# EasyEDA Pro project 4轴5.0控制板PCB源文件（LY-5X5.0-V3.1）.eprj, schematic 4轴-原理图-V01
Board Name: 4轴PCB; Create Date: 2024-07-26; Page Name: 4轴-原理图-V01; Project Name: LY-5X-V3.1; Schematic Name: 4轴-原理图-V01; Update Date: 2024-12-24; Address1: *; Address2: *; Address3: *; Address4: *; ApprovedBy: *; Author: *; CheckedBy: *; CompanyName: *; CurrentDate: *; CurrentTime: *; Date: *; DocumentFullPathAndName: *; DocumentName: *; DocumentNumber: *; DrawnBy: *; Engineer: *; ImagePath: *; ModifiedDate: *; Organization: *; ProjectName: *; Revision: *; Rule: *; SheetNumber: *; SheetTotal: *; Time: *; Title: *
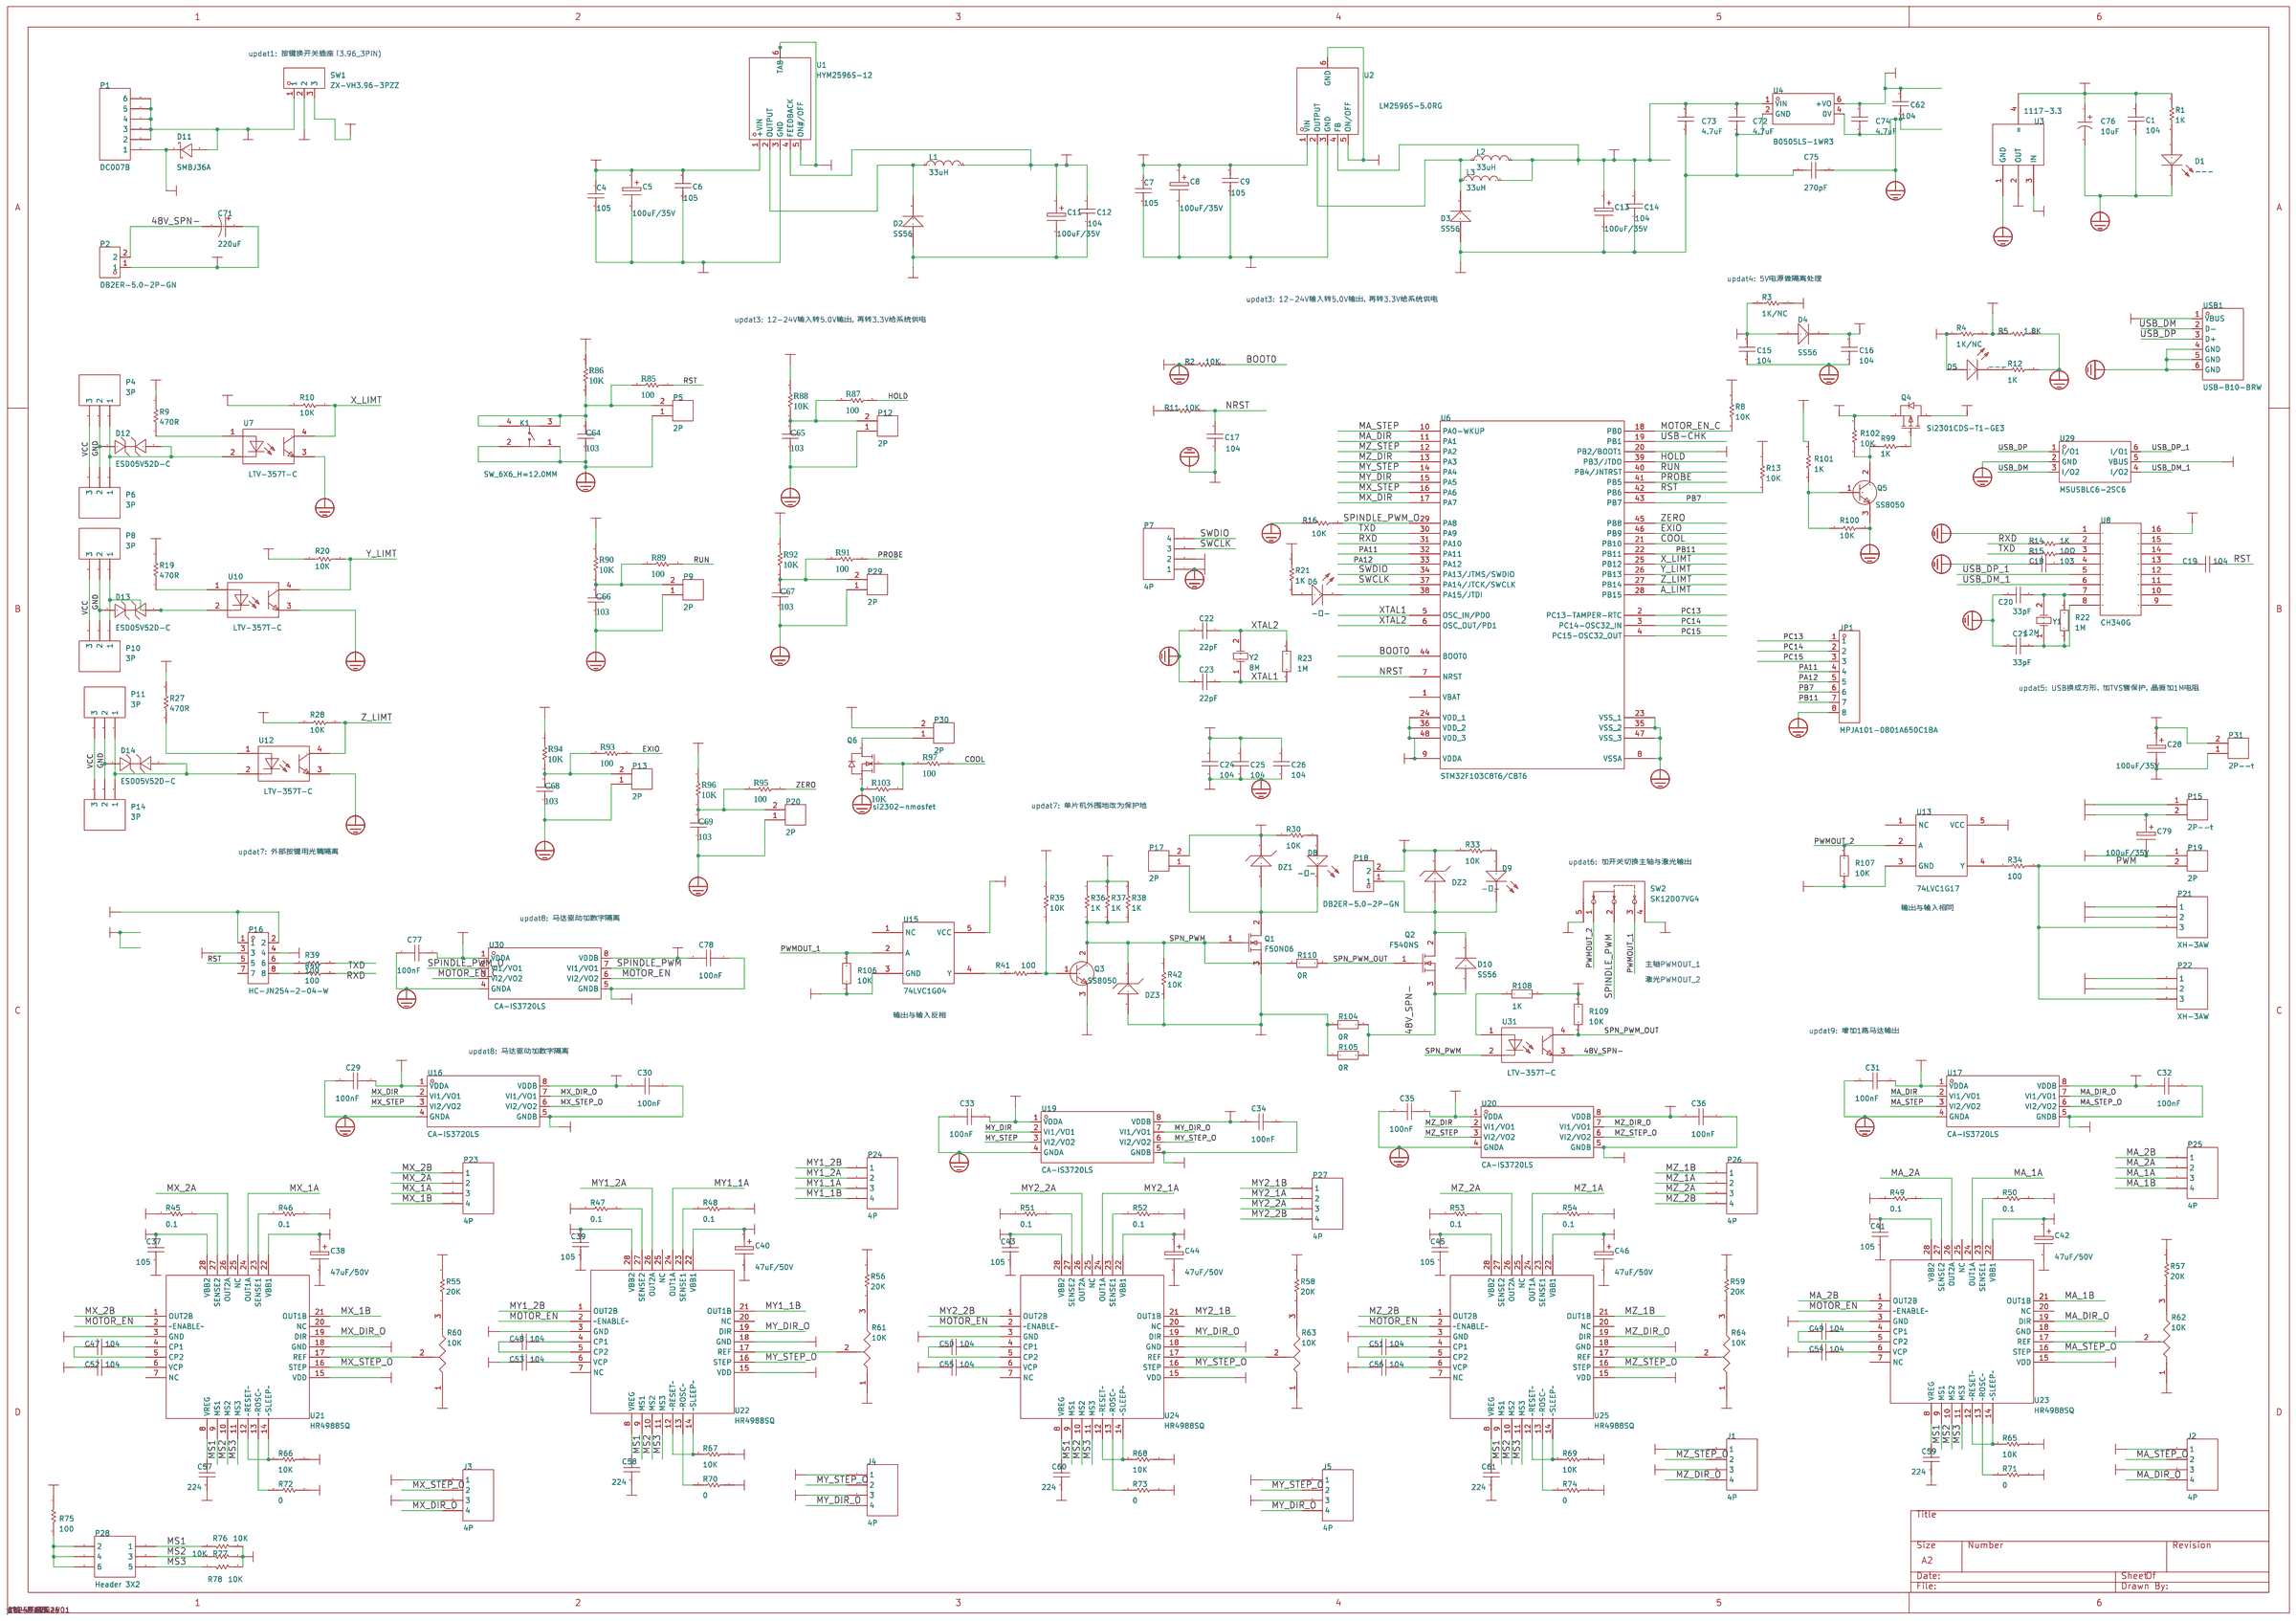
[diagram p0: schematic sheet]

## Parts
C1  104  [C0603]
C4  105  [0805C]
C5  100uF/35V  [电解电容贴片6x6]
C6  105  [0805C]
C7  105  [C0603]
C8  100uF/35V  [电解电容贴片6x6]
C9  105  [C0603]
C11  100uF/35V  [电解电容贴片6x6]
C12  104  [C0603]
C13  100uF/35V  [电解电容贴片6x6]
C14  104  [C0603]
C15  104  [C0603]
C16  104  [C0603]
C17  104  [C0603]
C18  103  [C0603]
C19  104  [C0603]
C20  18pF  [C0603]
C21  18pF  [C0603]
C22  100pF  [C0603]
C23  100pF  [C0603]
C24  104  [C0603]
C25  104  [C0603]
C26  104  [C0603]
C28  100uF/35V  [电解电容贴片6x6]
C29  100nF  [C0603]
C30  100nF  [C0603]
C31  100nF  [C0603]
C32  100nF  [C0603]
C33  100nF  [C0603]
C34  100nF  [C0603]
C35  100nF  [C0603]
C36  100nF  [C0603]
C37  105  [0805C]
C38  47uF/50V  [电解电容贴片6x6]
C39  105  [0805C]
C40  47uF/50V  [电解电容贴片6x6]
C41  105  [0805C]
C42  47uF/50V  [电解电容贴片6x6]
C43  105  [0805C]
C44  47uF/50V  [电解电容贴片6x6]
C45  105  [0805C]
C46  47uF/50V  [电解电容贴片6x6]
C47  104  [C0603]
C48  104  [C0603]
C49  104  [C0603]
C50  104  [C0603]
C51  104  [C0603]
C52  104  [C0603]
C53  104  [C0603]
C54  104  [C0603]
C55  104  [C0603]
C56  104  [C0603]
C57  224  [C0603]
C58  224  [C0603]
C59  224  [C0603]
C60  224  [C0603]
C61  224  [C0603]
C62  104  [C0603]
C64  103  [0603C]
C65  103  [0603C]
C66  103  [0603C]
C67  103  [0603C]
C68  103  [0603C]
C69  103  [0603C]
C71  220uF  [CAP-TH_BD12.5-P5.00-D0.6-FD]
C72  4.7uF  [C0805]
C73  4.7uF  [C0805]
C74  4.7uF  [C0805]
C75  270pF  [CAP-TH_L6.0-W2.5-P5.00-D1.0]
C76  10uF  [C0805]
C77  100nF  [C0603]
C78  100nF  [C0603]
C79  100uF/35V  [电解电容贴片6x6]
D1  ---  [0603LED]
D2  SS56  [SMA]
D3  SS56  [SMA]
D4  SS56  [SMA]
D5  ---  [0603LED]
D6  -̹-  [0603LED]
D8  -̹-  [0603LED]
D9  -̹-  [0603LED]
D10  SS56  [SMA]
D11  SMBJ36A  [SMB_L4.6-W3.6-LS5.3-RD]
D12  ESD05V52D-C  [SOD-523_L1.2-W0.8-LS1.6-BI]
D13  ESD05V52D-C  [SOD-523_L1.2-W0.8-LS1.6-BI]
D14  ESD05V52D-C  [SOD-523_L1.2-W0.8-LS1.6-BI]
DZ1  --ָ-------RS2M  [SMC]
DZ2  --ָ-------RS2M  [SMC]
DZ3  --ѹ------SMAZ10V  [SMA]
J1  4P  [HDR1X4_CON]
J2  4P  [HDR1X4_CON]
J3  4P  [HDR1X4_CON]
J4  4P  [HDR1X4_CON]
J5  4P  [HDR1X4_CON]
JP1  MPJA101-0801A650C1BA  [HDR-TH_8P-P2.54-V-F-R2-C5-S2.54_5-534206-4]
K1  SW_6X6_H=12.0MM  [KEY-SMD_4P-L6.0-W6.0-P4.50-LS9.0]
L1  33uH  [IND-SMD_L13.45-W12.6]
L2  33uH  [IND-SMD_L13.45-W12.6]
L3  33uH  [IND-SMD_L7.0-W7.0_SMDRI74-330MT]
P1  DC007B  [DC007B]
P2  DB2ER-5.0-2P-GN  [CONN-TH_2P-P5.00_DB2ER-5.0-2P-GN]
P4  3P  [HDR1X3_CON]
P5  2P  [HDR1X2_CON]
P6  3P  [HDR1X3_CON]
P7  4P  [SIP4]
P8  3P  [HDR1X3_CON]
P9  2P  [HDR1X2_CON]
P10  3P  [HDR1X3_CON]
P11  3P  [HDR1X3_CON]
P12  2P  [HDR1X2_CON]
P13  2P  [HDR1X2_CON]
P14  3P  [HDR1X3_CON]
P15  2P--ɫ  [HDR1X2_CON]
P16  HC-JN254-2-04-W  [HDR-TH_8P-P2.54-H-F-R2-C4-W9.0]
P17  2P  [CONN-TH_2P-P5.00_DB2ER-5.0-2P-GN]
P18  DB2ER-5.0-2P-GN  [CONN-TH_2P-P5.00_DB2ER-5.0-2P-GN]
P19  2P  [HDR1X2_CON]
P20  2P  [HDR1X2_CON]
P21  XH-3AW  [CONN-TH_3P-P2.54_HCTL_XH-3AW]
P22  XH-3AW  [CONN-TH_3P-P2.54_HCTL_XH-3AW]
P23  4P  [HDR1X4_CON]
P24  4P  [HDR1X4_CON]
P25  4P  [HDR1X4_CON]
P26  4P  [HDR1X4_CON]
P27  4P  [HDR1X4_CON]
P28  Header 3X2  [HDR2X3]
P29  2P  [HDR1X2_CON]
P30  2P  [HDR1X2_CON]
P31  2P--ɫ  [HDR1X2_CON]
Q1  F50N06  [TO-252]
Q2  F540NS  [TO-263-2]
Q3  SS8050  [SOT-23]
Q4  SI2301CDS-T1-GE3  [SOT-23-3_L3.0-W1.7-P0.95-LS2.9-BR]
Q5  SS8050  [SOT-23]
Q6  si2302-nmosfet  [SOT-23-3_L2.9-W1.3-P1.90-LS2.4-BR]
R1  1K  [0603R]
R2  10K  [0603R]
R3  1K/NC  [0603R]
R4  1K/NC  [0603R]
R5  1.8K  [0603R]
R8  10K  [0603R]
R9  470R  [0603R]
R10  10K  [0603R]
R11  10K  [0603R]
R12  1K  [0603R]
R13  10K  [0603R]
R14  1K  [0603R]
R15  10Ω  [0603R]
R16  10K  [0603R]
R19  470R  [0603R]
R20  10K  [0603R]
R21  1K  [0603R]
R22  1M  [R0603]
R23  1M  [R0603]
R27  470R  [0603R]
R28  10K  [0603R]
R30  10K  [0603R]
R33  10K  [0603R]
R34  100  [0603R]
R35  10K  [0603R]
R36  1K  [0603R]
R37  1K  [0603R]
R38  1K  [0603R]
R39  100  [0603R]
R40  100  [0603R]
R41  100  [0603R]
R42  10K  [0603R]
R45  0.1  [0805R]
R46  0.1  [0805R]
R47  0.1  [0805R]
R48  0.1  [0805R]
R49  0.1  [0805R]
R50  0.1  [0805R]
R51  0.1  [0805R]
R52  0.1  [0805R]
R53  0.1  [0805R]
R54  0.1  [0805R]
R55  20K  [0603R]
R56  20K  [0603R]
R57  20K  [0603R]
R58  20K  [0603R]
R59  20K  [0603R]
R60  10K  [松下贴片电位器3x3]
R61  10K  [松下贴片电位器3x3]
R62  10K  [松下贴片电位器3x3]
R63  10K  [松下贴片电位器3x3]
R64  10K  [松下贴片电位器3x3]
R65  10K  [0603R]
R66  10K  [0603R]
R67  10K  [0603R]
R68  10K  [0603R]
R69  10K  [0603R]
R70  0  [0603R]
R71  0  [0603R]
R72  0  [0603R]
R73  0  [0603R]
R74  0  [0603R]
R75  100  [0603R]
R76  10K  [0603R]
R77  10K  [0603R]
R78  10K  [0603R]
R85  100  [0603R]
R86  10K  [0603R]
R87  100  [0603R]
R88  10K  [0603R]
R89  100  [0603R]
R90  10K  [0603R]
R91  100  [0603R]
R92  10K  [0603R]
R93  100  [0603R]
R94  10K  [0603R]
R95  100  [0603R]
R96  10K  [0603R]
R97  100  [0603R]
R99  1K  [0603R]
R100  10K  [0603R]
R101  1K  [0603R]
R102  10K  [0603R]
R103  10K  [0603R]
R104  0R  [R1210]
R105  0R  [R1210]
R106  10K  [R0603]
R107  10K  [R0603]
R108  1K  [R0603]
R109  10K  [R0603]
R110  0R  [R0603]
SW1  ZX-VH3.96-3PZZ  [CONN-TH_3P-P3.96_MEGASTAR_ZX-VH3.96-3PZZ]
SW2  SK12D07VG4  [SW-TH_SK12D07VG4]
U1  HYM2596S-12  [TO-263-5_L10.2-W8.6-P1.70-LS14.4-BR]
U2  LM2596S-5.0RG  [TO-263-5_L10.1-W8.7-P1.70-LS15.2-BR]
U3  1117-3.3  [SOT-223]
U4  B0505LS-1WR3  [PWRM-TH_BXXXXLS-1WR3]
U6  STM32F103C8T6/CBT6  [LQFP48]
U7  LTV-357T-C  [SOP-4_L4.4-W3.9-P2.54-LS7.0-TL]
U8  CH340G  [SOP16]
U10  LTV-357T-C  [SOP-4_L4.4-W3.9-P2.54-LS7.0-TL]
U12  LTV-357T-C  [SOP-4_L4.4-W3.9-P2.54-LS7.0-TL]
U13  74LVC1G17  [SOT-23-5]
U15  74LVC1G04  [SOT-23-5]
U16  CA-IS3720LS  [SOIC-8_L4.9-W3.9-P1.27-LS6.0-BL]
U17  CA-IS3720LS  [SOIC-8_L4.9-W3.9-P1.27-LS6.0-BL]
U19  CA-IS3720LS  [SOIC-8_L4.9-W3.9-P1.27-LS6.0-BL]
U20  CA-IS3720LS  [SOIC-8_L4.9-W3.9-P1.27-LS6.0-BL]
U21  HR4988SQ  [QFN28]
U22  HR4988SQ  [QFN28]
U23  HR4988SQ  [QFN28]
U24  HR4988SQ  [QFN28]
U25  HR4988SQ  [QFN28]
U29  MSUSBLC6-2SC6  [SOT-23-6_L2.9-W1.6-P0.95-LS2.8-BL]
U30  CA-IS3720LS  [SOIC-8_L4.9-W3.9-P1.27-LS6.0-BL]
U31  LTV-357T-C  [SOP-4_L4.4-W3.9-P2.54-LS7.0-TL]
USB1  USB-B10-BRW  [USB-B-TH_USB-B10-BRW]
Y1  12M  [晶振贴片49SSMD]
Y2  8M  [晶振贴片]

## Library data of the parts
C1 C15 C16 C19 = 104: Capacitor (Semiconductor SIM Model); Published: 8-Jun-2000; LatestRevisionDate: 17-Jul-2002; LatestRevisionNote: Re-released for DXP Platform.; PackageReference: C1206; Publisher: Altium Limited; Origin Footprint 2: C1206; Origin Footprint 3: 0402; Origin Footprint 4: 1310[0504]; Origin Footprint 5: 1608[0603]; Origin Footprint 6: C1210; Origin Footprint 7: C0805; Origin Footprint 8: C1206; Origin Footprint 9: 0805; Origin Footprint 10: 0805L; Origin Footprint 1: 0603C; Design Item ID: Cap Semi; Library Name: Miscellaneous Devices
C4 C6 C7 C9 C37 C39 C41 C43 C45 = 105: Design Item ID: CAP; Library Name: SCH--װ--
C5 C8 C11 C13 C28 C79 = 100uF/35V: Origin Footprint 2: X47U; Origin Footprint 1: ________Ƭ6x6; Design Item ID: ELECTRO1; Library Name: *
C12 C14 C47-C56 C62 = 104: Design Item ID: CAP; Library Name: SCH--װ--
C17 = 104: Capacitor (Semiconductor SIM Model); Published: 8-Jun-2000; LatestRevisionDate: 17-Jul-2002; LatestRevisionNote: Re-released for DXP Platform.; PackageReference: C1206; Publisher: Altium Limited; Origin Footprint 2: C1206; Origin Footprint 3: 0402; Origin Footprint 4: 1310[0504]; Origin Footprint 5: 1608[0603]; Origin Footprint 6: C1210; Origin Footprint 7: C0805; Origin Footprint 8: C1206; Origin Footprint 9: 0805; Origin Footprint 10: 0805L; Origin Footprint 1: 0603C; Design Item ID: Cap Semi; Library Name: Miscellaneous Devices; Origin Footprint 11: 0805C
C18 = 103: Capacitor (Semiconductor SIM Model); Published: 8-Jun-2000; LatestRevisionDate: 17-Jul-2002; LatestRevisionNote: Re-released for DXP Platform.; PackageReference: C1206; Publisher: Altium Limited; Origin Footprint 2: C1206; Origin Footprint 3: 0402; Origin Footprint 4: 1310[0504]; Origin Footprint 5: 1608[0603]; Origin Footprint 6: C1210; Origin Footprint 7: C0805; Origin Footprint 8: C1206; Origin Footprint 9: 0805; Origin Footprint 10: 0805L; Origin Footprint 1: 0603C; Design Item ID: Cap Semi; Library Name: Miscellaneous Devices
C20 C21 = 33pF: Capacitor (Semiconductor SIM Model); Published: 8-Jun-2000; LatestRevisionDate: 17-Jul-2002; LatestRevisionNote: Re-released for DXP Platform.; PackageReference: C1206; Publisher: Altium Limited; Origin Footprint 2: C1206; Origin Footprint 3: 0402; Origin Footprint 4: 1310[0504]; Origin Footprint 5: 1608[0603]; Origin Footprint 6: C1210; Origin Footprint 7: C0805; Origin Footprint 8: C1206; Origin Footprint 9: 0805; Origin Footprint 10: 0805L; Origin Footprint 1: 0603C; Design Item ID: Cap Semi; Library Name: Miscellaneous Devices
C22 C23 = 22pF: Capacitor (Semiconductor SIM Model); Published: 8-Jun-2000; LatestRevisionDate: 17-Jul-2002; LatestRevisionNote: Re-released for DXP Platform.; PackageReference: C1206; Publisher: Altium Limited; Origin Footprint 2: C1206; Origin Footprint 3: 0402; Origin Footprint 4: 1310[0504]; Origin Footprint 5: 1608[0603]; Origin Footprint 6: C1210; Origin Footprint 7: C0805; Origin Footprint 8: C1206; Origin Footprint 9: 0805; Origin Footprint 10: 0805L; Origin Footprint 11: 0805C; Origin Footprint 1: 0603C; Design Item ID: Cap Semi; Library Name: Miscellaneous Devices
C24-C26 = 104: Origin Footprint 1: 0603C; Design Item ID: CAP; Library Name: SCH--װ--; Origin Footprint 2: CAP; Origin Footprint 3: 0805C
C29-C36 C77 C78 = CAP_0603: Supplier Footprint: 0603
C38 C40 C42 C44 C46 = 47uF/50V: Origin Footprint 2: X47U; Origin Footprint 1: ________Ƭ6x6; Design Item ID: ELECTRO1; Library Name: *
C57-C61 = 224: Design Item ID: CAP; Library Name: SCH--װ--
C64-C69 = 103: Design Item ID: CAP; Library Name: SCH--װ--
C71 = NXA 100V220 12.5*25: 容值:220uF;精度:±20%;额定电压:100V;; LCSC Part Name: 220uF±20%100V; Supplier Part: C165533; Manufacturer: SAMYOUNG(韩国三莹); Manufacturer Part: NXA100V22012.5*25; Supplier Footprint: 插件,D12.5xL25mm; JLCPCB Part Class: 扩展库; Datasheet: https://atta.szlcsc.com/upload/public/pdf/source/20190920/C430850_914054AA82C37226ADDF1C96892D647D.pdf; Supplier: LCSC; Tolerance: ±20%; Rated Voltage: 100V; Lead Spacing: 5mm; φD: 12.5mm; L: 25mm; Lifetime @ Temp: 10000hrs@105℃
C72-C74 = 1206B475K500NT: 容值:4.7uF;精度:±10%;额定电压:50V;材质(温度系数):X7R;; LCSC Part Name: 4.7uF±10%50V; Supplier Part: C29823; Manufacturer: FH(风华); Supplier Footprint: 1206; JLCPCB Part Class: 基础库; Datasheet: https://atta.szlcsc.com/upload/public/pdf/source/20200305/C486355_26A10D38EF8C2A5C37091D0039909270.pdf; Supplier: LCSC; Tolerance: ±10%; Voltage Rated: 50V; Temperature Coefficient: X7R
C75 = R06B1B271KN0B0S0N0: 容值:270pF;精度:±10%;额定电压:2kV;温度系数:Y5P;; LCSC Part Name: 270pF±10%2kV; Supplier Part: C2914698; Manufacturer: STE(松田); Supplier Footprint: 插件,P=5mm; JLCPCB Part Class: 扩展库; Datasheet: https://atta.szlcsc.com/upload/public/pdf/source/20211109/0AF9471D995859FB5026673B5F5DE464.pdf; Supplier: LCSC; Tolerance: ±10%; Voltage Rated: 2kV; Lead Spacing: 5mm; Temperature Coefficient: Y5P; φD: 6mm; Body Thickness: 3mm
C76 = CL21A106KAYNNNE_C15850: 容值:10uF;精度:±10%;额定电压:25V;材质(温度系数):X5R;; LCSC Part Name: 10uF ±10% 25V; Supplier Part: C15850; Manufacturer: SAMSUNG(三星); Manufacturer Part: CL21A106KAYNNNE; Supplier Footprint: 0805; JLCPCB Part Class: Basic Part; Datasheet: https://atta.szlcsc.com/upload/public/pdf/source/20160218/1457707763339.pdf; Supplier: LCSC; Tolerance: ±10%; Voltage Rated: 25V; Temperature Coefficient: X5R; Rated Voltage: 50V; φD: 5mm; L: 5.4mm; Lifetime @ Temp: 2000hrs@105℃; Operating Temperature: -55℃~+105℃
D1 D5 = ���: Origin Footprint 2: LED(С); Design Item ID: LED; Library Name: SCH--װ--
D2-D4 D10 = SS56: Design Item ID: 1N4148; Library Name: SCH--װ--
D6 D8 D9 = �̹�: Origin Footprint 2: LED(С); Design Item ID: LED; Library Name: SCH--װ--
D11 = SMBJ36A: 反向截止电压(Vrwm):36V;最大钳位电压:58.1V;峰值脉冲电流(Ipp)@10/1000us:10.3A;击穿电压:40V;; Supplier Part: C143165; Manufacturer: FMS(美丽微); Supplier Footprint: SMB(DO-214AA); JLCPCB Part Class: 扩展库; Datasheet: https://atta.szlcsc.com/upload/public/pdf/source/20191125/C461412_D06D094152DCAA63D23E11D143615915.pdf; Supplier: LCSC; Reverse Stand-Off Voltage (Vrwm): 36V; Maximum Clamping Voltage: 58.1V; Peak Pulse Current (Ipp)@10/1000us: 10.3A; Breakdown Voltage: 40V; Type: TVS
D12-D14 = ESD05V52D-C: 极性：双向反向截止电压(Vrwm)：5V击穿电压(VBR)：5.6V钳位电压(Vc)@Ipp：15V反向截止电压(Vrwm)：5V击穿电压(最小值)：5.6V峰值脉冲电流(Ipp)@tp=8/20μs：5A最大钳位电压：15V; Supplier Part: C727170; Manufacturer: TWGMC(台湾迪嘉); Supplier Footprint: SOD-523; JLCPCB Part Class: 扩展库; Datasheet: https://atta.szlcsc.com/upload/public/pdf/source/20200827/C727170_700AFDE065FF081A69A0C04747B3686A.pdf; Supplier: LCSC
DZ1 DZ2 = ��ָ�������RS2M: Design Item ID: --ѹ------; Library Name: SCH--װ--
DZ3 = ��ѹ������SMAZ10V: Design Item ID: --ѹ------; Library Name: SCH--װ--
J1-J5 P7 P23-P27 = 4P: Library Name: SCH--װ--
JP1 = MPJA101-0801A650C1BA: Supplier Part: C9900009548; Supplier Footprint: 3.96间距公座8PIN空偶数PIN; JLCPCB Part Class: 扩展库; Supplier: LCSC
K1 = SW_6X6_H=12.0MM: Supplier Part: C9900018802; Supplier Footprint: KEY-SMD; JLCPCB Part Class: 扩展库; Supplier: LCSC
L1 L2 = MWSA1206S-330MT: 电感值:33uH;精度:±20%;额定电流:5.5A;饱和电流(Isat):6A;类型:-;; LCSC Part Name: 33uH±20%6A; Supplier Part: C408530; Manufacturer: Sunlord(顺络); Supplier Footprint: SMD; JLCPCB Part Class: 扩展库; Datasheet: https://atta.szlcsc.com/upload/public/pdf/source/20231024/D9DB0CBBB5804BFBC9233D4A02F4216A.pdf; Supplier: LCSC; Tolerance: ±20%; Rated Current: 5.5A; Saturation Current (Isat): 6A; DC Resistance (DCR): 75mΩ
L3 = SMDRI74-330MT: 电感值:33uH;精度:±20%;额定电流:960mA;饱和电流(Isat):1.8A;类型:屏蔽电感;; LCSC Part Name: 33uH±20%1.8A; Supplier Part: C49625; Manufacturer: SXN(顺翔诺); Supplier Footprint: SMD,7.5x7.5mm; JLCPCB Part Class: 扩展库; Datasheet: https://atta.szlcsc.com/upload/public/pdf/source/20210810/6F96FDC19AA308DD2AD166FFB9640E87.pdf; Supplier: LCSC; Tolerance: ±20%; Rated Current: 960mA; Saturation Current (Isat): 1.8A; DC Resistance (DCR): 170mΩ; Type: 屏蔽电感
P1 = DC007B: Design Item ID: 6P; Library Name: SCH--װ--
P2 P18 = DB2ER-5.0-2P-GN: 间距:5mm;颜色:绿色;排数:1;每排PIN数:2;额定电流:15A;额定电压:630V;触头镀层:锡;; LCSC Part Name: 5mm排数:1每排P数:2; Supplier Part: C5454428; Manufacturer: DORABO(地博电气); Supplier Footprint: P=5mm; JLCPCB Part Class: 扩展库; Datasheet: https://atta.szlcsc.com/upload/public/pdf/source/20230427/39CC0BD2D36F5E0FC60100946C6C8B3A.pdf; Supplier: LCSC; Pitch: 5mm; Color: 绿色; Number of Pins: 2P; Number of Rows: 1; Number of PINs Per Row: 2; Current Rating (Max): 15A; Voltage Rating (Max): 630V; Contact Plating: 锡
P4 P6 P8 P10 P11 P14 = 3P: Library Name: SCH--װ--
P5 P9 P12 P13 P17 P19 P20 P29 P30 = 2P: Library Name: SCH--װ--
P15 P31 = 2P��ɫ: Design Item ID: 2P; Library Name: SCH--װ--
P16 = HC-JN254-2-04-W: 连接器类型:简牛座;间距:2.54mm;结构:2x4P;额定电流:3A;封装形式:弯插;行距:2.54mm;排数:2;每排PIN数:4;触头材质:黄铜;触头镀层:金;工作温度范围:-40℃~+105℃;焊接温度(最大值):260℃@10S;; LCSC Part Name: 2.54mm2x4P排数:2每排P数:4; Supplier Part: C5372872; Manufacturer: HCTL(华灿天禄); Supplier Footprint: 弯插,P=2.54mm; JLCPCB Part Class: 扩展库; Datasheet: https://atta.szlcsc.com/upload/public/pdf/source/20230314/29278A24539954283B80828B9C32CD4C.pdf; Supplier: LCSC; Connector Type: 简牛座; Pitch: 2.54mm; Structure: 2x4P; Current Rating (Max): 3A; Holder Type: 弯插; Row Spacing: 2.54mm; Number of Rows: 2; Pin Number in each Row: 4; Contact Material: 黄铜; Contact Plating: 金; Operating Temperature Range: -40℃~+105℃; Soldering Temperature(Max): 260℃@10S
P21 P22 = XH-3AW_C2908612: 插针结构:1x3P;间距:2.54mm;安装方式:弯插;参考系列:XH;总PIN数:3P;排数:1;每排PIN数:3;行距:-;额定电流:3A;触头材质:黄铜;触头镀层:锡;工作温度范围:-25℃~+85℃;; LCSC Part Name: 1x3P间距:2.54mm弯插系列:XH; Supplier Part: C2908612; Manufacturer: HCTL(华灿天禄); Supplier Footprint: 弯插,P=2.54mm; JLCPCB Part Class: ExtendedPart; Datasheet: https://atta.szlcsc.com/upload/public/pdf/source/20230711/B565BAF3B11666EF6B81B3605408F2BD.pdf; Supplier: LCSC; Pins Structure: 1x3P; Pitch: 2.54mm; Mounting Style: 弯插; Reference Series: XH; Number of Pins: 3P; Number of Rows: 1; Number of PINs Per Row: 3; Current Rating (Max): 3A; Contact Material: 黄铜; Contact Plating: 锡; Operating Temperature Range: -25℃~+85℃; Design Item ID: 3P; Library Name: SCH--װ--
P28 = Header 3X2: Header, 3-Pin, Dual row; LatestRevisionDate: 17-Jul-2002; LatestRevisionNote: Re-released for DXP Platform.; Publisher: Altium Limited; Library Name: Miscellaneous Connectors
Q1 = F50N06: N-Channel MOSFET; Published: 8-Jun-2000; LatestRevisionDate: 17-Jul-2002; LatestRevisionNote: Re-released for DXP Platform.; PackageVersion: 1995/1996; PackageReference: E3; Publisher: Altium Limited; Design Item ID: MOSFET-N; Library Name: SCH--װ--
Q2 = F540NS: N-Channel MOSFET; Published: 8-Jun-2000; LatestRevisionDate: 17-Jul-2002; LatestRevisionNote: Re-released for DXP Platform.; PackageVersion: 1995/1996; PackageReference: E3; Publisher: Altium Limited; Design Item ID: MOSFET-N; Library Name: SCH--װ--
Q3 Q5 = SS8050: Published: 8-Jun-2000; LatestRevisionDate: 17-Jul-2002; LatestRevisionNote: Re-released for DXP Platform.; PackageReference: TO-226; Publisher: Altium Limited; Code_JEDEC: TO-226-AA; Origin Footprint 2: TO-92; Design Item ID: NPN; Library Name: SCH--װ--
Q4 = SI2301CDS-T1-GE3: 类型:1个P沟道;漏源电压(Vdss):20V;连续漏极电流(Id):3.1A;功率(Pd):860mW；1.6W;导通电阻(RDS(on)@Vgs,Id):112mΩ@4.5V,2.8A;阈值电压(Vgs(th)@Id):1V@250uA;; LCSC Part Name: 1个P沟道耐压:20V电流:3.1A; Supplier Part: C10487; Manufacturer: VISHAY(威世); Supplier Footprint: SOT-23; JLCPCB Part Class: 基础库; Datasheet: https://atta.szlcsc.com/upload/public/pdf/source/20180621/C10487_757133A2CC00440C4C7DD3E7E73681E9.pdf; Supplier: LCSC; Type: 1个P沟道; Drain Source Voltage (Vdss): 20V; Continuous Drain Current (Id): 3.1A; Power Dissipation (Pd): 860mW；1.6W; Drain Source On Resistance (RDS(on)@Vgs,Id): 112mΩ@4.5V,2.8A; Gate Threshold Voltage (Vgs(th)@Id): 1V@250uA; Total Gate Charge (Qg@Vgs): 10nC@4.5V; Input Capacitance (Ciss@Vds): 405pF@10V; Operating Temperature: -55℃~+150℃@(Tj)
Q6 = si2302-nmosfet: Supplier Part: C9900002167; Supplier Footprint: SOT-23; JLCPCB Part Class: 扩展库; Supplier: LCSC
R1 R21 R36-R38 R99 = 1K: Resistor; Published: 8-Jun-2000; LatestRevisionDate: 17-Jul-2002; LatestRevisionNote: Re-released for DXP Platform.; PackageReference: AXIAL-0.3; Publisher: Altium Limited; Origin Footprint 2: AXIAL-0.3; Origin Footprint 3: R0805; Origin Footprint 4: 0805R; Design Item ID: RES; Library Name: SCH--װ--
R2 R11 R16 = 10K: Resistor; Published: 8-Jun-2000; LatestRevisionDate: 17-Jul-2002; LatestRevisionNote: Re-released for DXP Platform.; PackageReference: AXIAL-0.3; Publisher: Altium Limited; Origin Footprint 2: AXIAL-0.3; Origin Footprint 3: 0805R; Origin Footprint 4: 0805R; Design Item ID: RES; Library Name: SCH--װ--
R3 = 1K!!: Resistor; Published: 8-Jun-2000; LatestRevisionDate: 17-Jul-2002; LatestRevisionNote: Re-released for DXP Platform.; PackageReference: AXIAL-0.3; Publisher: Altium Limited; Origin Footprint 2: AXIAL-0.3; Origin Footprint 3: R0805; Design Item ID: RES; Library Name: SCH--װ--
R4 = 1K?: Resistor; Published: 8-Jun-2000; LatestRevisionDate: 17-Jul-2002; LatestRevisionNote: Re-released for DXP Platform.; PackageReference: AXIAL-0.3; Publisher: Altium Limited; Origin Footprint 2: AXIAL-0.3; Origin Footprint 3: R0805; Design Item ID: RES; Library Name: SCH--װ--
R5 = 1.8K: Resistor; Published: 8-Jun-2000; LatestRevisionDate: 17-Jul-2002; LatestRevisionNote: Re-released for DXP Platform.; PackageReference: AXIAL-0.3; Publisher: Altium Limited; Origin Footprint 2: AXIAL-0.3; Origin Footprint 3: R0805; Design Item ID: RES; Library Name: SCH--װ--
R8 = RES: Resistor; Published: 8-Jun-2000; LatestRevisionDate: 17-Jul-2002; LatestRevisionNote: Re-released for DXP Platform.; PackageReference: AXIAL-0.3; Publisher: Altium Limited; Origin Footprint 2: AXIAL-0.3; Origin Footprint 3: 0805R; Library Name: SCH--װ--
R9 R13 R19 R27 R30 R33 R35 R42 R65-R69 R76-R78 R86 R88 R90 R92 R94 R96 R100-R102 = 10K: Resistor; Published: 8-Jun-2000; LatestRevisionDate: 17-Jul-2002; LatestRevisionNote: Re-released for DXP Platform.; PackageReference: AXIAL-0.3; Publisher: Altium Limited; Origin Footprint 2: AXIAL-0.3; Origin Footprint 3: R0805; Origin Footprint 4: 0805R; Design Item ID: RES; Library Name: SCH--װ--
R10 R15 R20 R28 R34 R39-R41 R75 R85 R87 R89 R91 R93 R95 R97 R103 = 100: Resistor; Published: 8-Jun-2000; LatestRevisionDate: 17-Jul-2002; LatestRevisionNote: Re-released for DXP Platform.; PackageReference: AXIAL-0.3; Publisher: Altium Limited; Origin Footprint 2: AXIAL-0.3; Origin Footprint 3: R0805; Origin Footprint 4: 0805R; Design Item ID: RES; Library Name: SCH--װ--
R12 = 1K: Resistor; Published: 8-Jun-2000; LatestRevisionDate: 17-Jul-2002; LatestRevisionNote: Re-released for DXP Platform.; PackageReference: AXIAL-0.3; Publisher: Altium Limited; Origin Footprint 2: AXIAL-0.3; Origin Footprint 3: R0805; Design Item ID: RES; Library Name: SCH--װ--
R14 = 680!!: Resistor; Published: 8-Jun-2000; LatestRevisionDate: 17-Jul-2002; LatestRevisionNote: Re-released for DXP Platform.; PackageReference: AXIAL-0.3; Publisher: Altium Limited; Origin Footprint 2: AXIAL-0.3; Origin Footprint 3: R0805; Origin Footprint 4: 0805R; Design Item ID: RES; Library Name: SCH--װ--
R22 R23 R106-R110 = Res_0603: Supplier Footprint: 0603
R45-R54 = 0.1: Resistor; Published: 8-Jun-2000; LatestRevisionDate: 17-Jul-2002; LatestRevisionNote: Re-released for DXP Platform.; PackageReference: AXIAL-0.3; Publisher: Altium Limited; Origin Footprint 2: AXIAL-0.3; Origin Footprint 3: R0805; Origin Footprint 4: 0603R; Design Item ID: RES; Library Name: SCH--װ--
R55-R59 = 20K: Resistor; Published: 8-Jun-2000; LatestRevisionDate: 17-Jul-2002; LatestRevisionNote: Re-released for DXP Platform.; PackageReference: AXIAL-0.3; Publisher: Altium Limited; Origin Footprint 2: AXIAL-0.3; Origin Footprint 3: R0805; Origin Footprint 4: 0805R; Design Item ID: RES; Library Name: SCH--װ--
R60-R64 = 10K: Design Item ID: --λ--; Library Name: SCH--װ--
R70-R74 = 0: Resistor; Published: 8-Jun-2000; LatestRevisionDate: 17-Jul-2002; LatestRevisionNote: Re-released for DXP Platform.; PackageReference: AXIAL-0.3; Publisher: Altium Limited; Origin Footprint 2: AXIAL-0.3; Origin Footprint 3: R0805; Origin Footprint 4: 0805R; Design Item ID: RES; Library Name: SCH--װ--
R104 R105 = Res_1210: Supplier Footprint: 1210
SW1 = ZX-VH3.96-3PZZ: 插针结构:1x3P;间距:3.96mm;安装方式:直插;参考系列:VH;总PIN数:3P;排数:1;每排PIN数:3;行距:-;额定电流:3A;触头材质:黄铜;触头镀层:锡;工作温度范围:-25℃~+85℃;; Supplier Part: C7429661; Manufacturer: Megastar(兆星); Supplier Footprint: 插件,P=3.96mm; JLCPCB Part Class: 扩展库; Datasheet: https://atta.szlcsc.com/upload/public/pdf/source/20230619/665D90E085E5CFCDC5B674AE560E2F18.pdf; Supplier: LCSC; Pins Structure: 1x3P; Pitch: 3.96mm; Mounting Style: 直插; Reference Series: VH; Number of Pins: 3P; Number of Rows: 1; Number of PINs Per Row: 3; Current Rating (Max): 3A; Contact Material: 黄铜; Contact Plating: 锡; Operating Temperature Range: -25℃~+85℃
SW2 = SK12D07VG4: 电路结构:单刀双掷;安装方式:侧插;额定电流(DC):500mA;额定电压(DC):50V;额定电流(AC):-;额定电压(AC):-;机械寿命:5千次;; LCSC Part Name: 3脚2档位卧插滑动开关; Supplier Part: C393937; Manufacturer: SHOUHAN(首韩); Supplier Footprint: 插件; JLCPCB Part Class: 扩展库; Datasheet: https://atta.szlcsc.com/upload/public/pdf/source/20190521/C393937_939FE26E571CC67D2D532E953108A1B0.pdf; Supplier: LCSC; Circuit: 单刀双掷; Actuator Style: 矩形柱状; Pin Style: PC引脚; Switch Height: 8.8mm; Mounting Style: 侧插; Current Rating (DC): 500mA; Voltage Rating (DC): 50V; Mechanical Life: 5千次
U1 = HYM2596S-12: 功能类型:降压型;输入电压:-;输出电流(最大值):-;; Supplier Part: C166696; Manufacturer: HAOYU(昊昱); Supplier Footprint: TO-263-5; JLCPCB Part Class: 扩展库; Datasheet: https://atta.szlcsc.com/upload/public/pdf/source/20180126/C166697_15169517382381308528.pdf; Supplier: LCSC; Function: 降压型; Switch tube (built-in/external): 内置
U2 = LM2596S-5.0RG_C5157156: Supplier Part: C5157156; Manufacturer: HGC(深圳汉芯); Supplier Footprint: TO-263-5; JLCPCB Part Class: 扩展库; Datasheet: https://atta.szlcsc.com/upload/public/pdf/source/20220308/5E7E021717B07C63974FB4CE30FAB155.pdf; Supplier: LCSC
U3 = 1117-3.3: Design Item ID: LM1117; Library Name: Party600
U4 = B0505LS-1WR3: 转换类型:DC-DC;输入电压(DC):4.5V~5.5V;输出电压:5V;输出电流(最大值):200mA;功能类型:-;; Supplier Part: C909800; Manufacturer: DEXU(德旭电子); Supplier Footprint: 插件; JLCPCB Part Class: 扩展库; Datasheet: https://atta.szlcsc.com/upload/public/pdf/source/20220506/97E51FF679E86FC18F266BBBBBA200F9.pdf; Supplier: LCSC; Conversion Type: DC-DC; Input Voltage(DC): 4.5V~5.5V; Output Voltage: 5V; Output Current (Max): 200mA; Output Channel: 1
U6 = STM32F103C8T6/CBT6: STM32 ARM-based 32-bit MCU with 32 Kbytes Flash, 48-pin LQFP, Industrial Temperature; Published: *; DatasheetVersion: *; PackageVersion: *; PackageReference: *; Publisher: *; PackageDescription: *; ComponentLink1Description: *; ComponentLink1URL: *; ComponentLink2Description: *; ComponentLink2URL: *; Origin Footprint 2: LQFP48_L; Origin Footprint 3: LQFP48_M; Design Item ID: STM32F103C6T6; Library Name: ST Microcontroller 32-Bit STM32 SCH
U7 U10 U12 U31 = LTV-357T-C: 输入电压类型:DC;正向电压:1.2V;输出电流:50mA;隔离电压(rms):3.75kV;反向电压:6V;接收端电压:35V;输出通道数:1;集射极饱和电压(Vce(sat)@Ic,IF):200mV@1mA,20mA;; LCSC Part Name: DC输入隔离电压(rms):3750V; Supplier Part: C119091; Manufacturer: LITEON(光宝); Supplier Footprint: SOP-4-2.54mm; JLCPCB Part Class: 扩展库; Datasheet: https://atta.szlcsc.com/upload/public/pdf/source/20170930/C133128_1506736380934997376.pdf; Supplier: LCSC; Input voltage type: DC; Output Type: 光电三极管; Forward Voltage: 1.2V; Output Current: 50mA; Isolation Voltage(rms): 3.75kV; Reverse Voltage: 6V; Receiving End Voltage: 35V; Number of Outputs: 1; Collector-Emitter Saturation Voltage (Vce(sat)@Ic,IF): 200mV@1mA,20mA; Rise time: 4us@2mA,100Ω; Fall time: 3us@2mA,100Ω; Operating Temperature: -55℃~+110℃
U8 = CH340G: Design Item ID: DIP16; Library Name: SCH--װ--
U13 = 74LVC1G17: Library Name: SCH--װ--
U15 = 74LVC1G04: Design Item ID: 74LVC1G17; Library Name: SCH--װ--
U16 U17 U19 U20 U30 = CA-IS3720LS: LCSC Part Name: CA-IS372x高速双通道数字隔离器; Supplier Part: C5121215; Manufacturer: Chipanalog(川土微); Supplier Footprint: SOIC-8; JLCPCB Part Class: 扩展库; Datasheet: https://atta.szlcsc.com/upload/public/pdf/source/20220817/B10411DCED9A45C0160465FE161A7C01.pdf; Supplier: LCSC
U21-U25 = HR4988SQ: Design Item ID: HR4988; Library Name: SCH--װ--
U29 = MSUSBLC6-2SC6: 反向截止电压(Vrwm):5V;最大钳位电压:15V;峰值脉冲电流(Ipp)@10/1000us:6A;峰值脉冲功率(Ppp)@10/1000us:150W;击穿电压:9V;; LCSC Part Name: UL26; Supplier Part: C2830148; Manufacturer: MSKSEMI(美森科); Supplier Footprint: SOT-23-6; JLCPCB Part Class: 扩展库; Datasheet: https://atta.szlcsc.com/upload/public/pdf/source/20210623/C2830148_830D5495FDC11AF9D5769967D4D0CCFD.pdf; Supplier: LCSC; Reverse Stand-Off Voltage (Vrwm): 5V; Maximum Clamping Voltage: 15V; Peak Pulse Current (Ipp)@10/1000us: 6A; Peak Pulse Power Dissipation (Ppp)@10/1000us: 150W; Breakdown Voltage: 9V; Type: ESD
USB1 = USB-B10-BRW: 连接器类型:Type-B;标准:USB2.0;公母:母;端口数量:1;触点数量:4P;安装方式:弯插;额定电流-电源:1.5A;工作温度范围:-20℃~+70℃;焊接温度(最大值):260℃;; LCSC Part Name: Type-B母弯插; Supplier Part: C720549; Manufacturer: XUNPU(讯普); Supplier Footprint: 插件; JLCPCB Part Class: 扩展库; Datasheet: https://atta.szlcsc.com/upload/public/pdf/source/20200812/C720549_53E9294752E2933874870440E626C579.pdf; Supplier: LCSC; Connector Type: Type-B; Standard: USB2.0; Gender: 母; Number of Ports: 1; Number of Contacts: 4P; Mounting Style: 弯插; Current Rating - Power (Max): 1.5A; Operating Temperature Range: -20℃~+70℃; Soldering Temperature(Max): 260℃
Y1 = 12M: Crystal Oscillator; Published: 8-Jun-2000; LatestRevisionDate: 17-Jul-2002; LatestRevisionNote: Re-released for DXP Platform.; PackageReference: R38; Publisher: Altium Limited; Origin Footprint 2: R38; Origin Footprint 3: XTAL-49S; Origin Footprint 1: ______Ƭ49SSMD; Design Item ID: XTAL; Library Name: Miscellaneous Devices
Y2 = 8M: Crystal Oscillator; Published: 8-Jun-2000; LatestRevisionDate: 17-Jul-2002; LatestRevisionNote: Re-released for DXP Platform.; PackageReference: R38; Publisher: Altium Limited; Origin Footprint 2: R38; Origin Footprint 3: XTAL-49S; Origin Footprint 1: ______Ƭ; Design Item ID: XTAL; Library Name: Miscellaneous Devices

## Nets
3V3: C1.2 C24.2 C25.2 C26.2 C29.1 C31.1 C33.1 C35.1 C76.1 C77.1 P7.2 R1.1 R8.2 R10.2 R11.1 R13.1 R20.2 R21.2 R28.2 R86.2 R88.2 R90.2 R92.2 R94.2 R96.2 U3.2(OUT) U3.4(=) U6.9(VDDA) U6.24(VDD_1) U6.36(VDD_2) U6.48(VDD_3) U16.1(VDDA) U17.1(VDDA) U19.1(VDDA) U20.1(VDDA) U30.1(VDDA)
5V: C16.2 C62.2 C74.2 D4.2 P16.1 P16.2 P30.2 Q4.2(S) R102.2 U3.3(IN) U4.6(+VO)
12V: C11.1 C12.2 C79.1 L1.2 P15.2 P21.1 R36.2 R37.2 R38.2 R108.2 R109.2 U1.4(FEEDBACK)
24V: C4.1 C5.1 C6.2 C7.1 C8.1 C9.2 C28.1 C37.1 C38.1 C39.1 C40.1 C41.1 C42.1 C43.1 C44.1 C45.1 C46.1 C52.2 C53.2 C54.2 C55.2 C56.2 DZ1.2 P17.2 P22.1 P31.2 R30.1 SW1.3 U1.1(+VIN) U2.1(VIN) U21.22(VBB1) U21.28(VBB2) U22.22(VBB1) U22.28(VBB2) U23.22(VBB1) U23.28(VBB2) U24.22(VBB1) U24.28(VBB2) U25.22(VBB1) U25.28(VBB2)
24V_IN: D11.1(K) P1.1 SW1.2
48V_SPN-: C71.2 D10.1 P2.2 Q2.3(S) R104.2 R105.2 U31.3
GND: C4.2 C5.2 C6.1 C7.2 C8.2 C9.1 C11.2 C12.1 C13.2 C14.1 C28.2 C30.1 C32.1 C34.1 C36.1 C37.2 C38.2 C39.2 C40.2 C41.2 C42.2 C43.2 C44.2 C45.2 C46.2 C57.2 C58.2 C59.2 C60.2 C61.2 C72.1 C73.1 C75.1 C78.1 C79.2 D2.1 D3.1 D11.2(A) D12.1 D13.1 D14.1 DZ3.1 P1.2 P1.3 P1.4 P1.5 P1.6 P4.2 P6.2 P8.2 P10.2 P11.2 P14.2 P15.1 P19.1 P21.2 P22.2 P31.1 Q1.3(S) Q3.3(E) R42.2 R45.2 R46.1 R47.2 R48.1 R49.2 R50.1 R51.2 R52.1 R53.2 R54.1 R60.1(A) R61.1(A) R62.1(A) R63.1(A) R64.1(A) R70.1 R71.1 R72.1 R73.1 R74.1 R76.2 R77.2 R78.2 R104.1 R105.1 R106.1 R107.1 SW1.1 SW2.4 SW2.5 U1.3(GND) U1.5(ON#/OFF) U1.6(TAB) U2.3(GND) U2.5(ON/OFF) U2.6(GND) U4.2(GND) U13.3(GND) U15.3(GND) U16.5(GNDB) U17.5(GNDB) U19.5(GNDB) U20.5(GNDB) U21.3(GND) U21.18(GND) U22.3(GND) U22.18(GND) U23.3(GND) U23.18(GND) U24.3(GND) U24.18(GND) U25.3(GND) U25.18(GND) U30.5(GNDB)
PGND: C1.1 C15.1 C16.1 C17.1 C18.2 C20.2 C21.2 C22.2 C23.2 C24.1 C25.1 C26.1 C29.2 C31.2 C33.2 C35.2 C62.1 C64.1 C65.1 C66.1 C67.1 C68.1 C69.1 C74.1 C75.2 C76.2 C77.2 D1.2 JP1.8 K1.1 K1.2 P5.1 P7.1 P9.1 P12.1 P13.1 P16.3 P16.4 P20.1 P29.1 Q5.3(E) Q6.2(S) R2.1 R3.1 R5.2 R12.1 R16.1 R100.2 R103.2 U3.1(GND) U4.4(0V) U6.8(VSSA) U6.20(PB2/BOOT1) U6.23(VSS_1) U6.35(VSS_2) U6.47(VSS_3) U7.3 U8.1 U10.3 U12.3 U16.4(GNDA) U17.4(GNDA) U19.4(GNDA) U20.4(GNDA) U29.2(GND) U30.4(GNDA) USB1.4(GND) USB1.5(GND) USB1.6(GND)
VCC: C13.1 C14.2 C30.2 C32.2 C34.2 C36.2 C72.2 C73.2 C78.2 J1.1 J1.3 J2.1 J2.3 J3.1 J3.3 J4.1 J4.3 J5.1 J5.3 L2.2 L3.2 P4.3 P6.3 P8.3 P10.3 P11.3 P14.3 R9.2 R19.2 R27.2 R35.2 R55.2 R56.2 R57.2 R58.2 R59.2 R65.1 R66.1 R67.1 R68.1 R69.1 R75.1 U2.4(FB) U4.1(VIN) U13.5(VCC) U15.5(VCC) U16.8(VDDB) U17.8(VDDB) U19.8(VDDB) U20.8(VDDB) U21.15(VDD) U22.15(VDD) U23.15(VDD) U24.15(VDD) U25.15(VDD) U30.8(VDDB)
A_LIMT: U6.28(PB15)
BOOT0: R2.2 U6.44(BOOT0)
COOL: R97.1 U6.21(PB10)
EXIO: R93.1 U6.46(PB9)
HOLD: R87.1 U6.39(PB3/JTDO)
MA_1A: P25.3 U23.24(OUT1A)
MA_1B: P25.4 U23.21(OUT1B)
MA_2A: P25.2 U23.26(OUT2A)
MA_2B: P25.1 U23.1(OUT2B)
MA_DIR: U6.11(PA1) U17.2(VI1/VO1)
MA_DIR_O: J2.4 U17.7(VI1/VO1) U23.19(DIR)
MA_STEP: U6.10(PA0-WKUP) U17.3(VI2/VO2)
MA_STEP_O: J2.2 U17.6(VI2/VO2) U23.16(STEP)
MOTOR_EN: U21.2(~ENABLE~) U22.2(~ENABLE~) U23.2(~ENABLE~) U24.2(~ENABLE~) U25.2(~ENABLE~) U30.6(VI2/VO2)
MOTOR_EN_C: R8.1 U6.18(PB0) U30.3(VI2/VO2)
MS1: P28.1 R76.1 U21.9(MS1) U22.9(MS1) U23.9(MS1) U24.9(MS1) U25.9(MS1)
MS2: P28.3 R77.1 U21.10(MS2) U22.10(MS2) U23.10(MS2) U24.10(MS2) U25.10(MS2)
MS3: P28.5 R78.1 U21.11(MS3) U22.11(MS3) U23.11(MS3) U24.11(MS3) U25.11(MS3)
MX_1A: P23.3 U21.24(OUT1A)
MX_1B: P23.4 U21.21(OUT1B)
MX_2A: P23.2 U21.26(OUT2A)
MX_2B: P23.1 U21.1(OUT2B)
MX_DIR: U6.17(PA7) U16.2(VI1/VO1)
MX_DIR_O: J3.4 U16.7(VI1/VO1) U21.19(DIR)
MX_STEP: U6.16(PA6) U16.3(VI2/VO2)
MX_STEP_O: J3.2 U16.6(VI2/VO2) U21.16(STEP)
MY1_1A: P24.3 U22.24(OUT1A)
MY1_1B: P24.4 U22.21(OUT1B)
MY1_2A: P24.2 U22.26(OUT2A)
MY1_2B: P24.1 U22.1(OUT2B)
MY2_1A: P27.2 U24.24(OUT1A)
MY2_1B: P27.1 U24.21(OUT1B)
MY2_2A: P27.3 U24.26(OUT2A)
MY2_2B: P27.4 U24.1(OUT2B)
MY_DIR: U6.15(PA5) U19.2(VI1/VO1)
MY_DIR_O: J4.4 J5.4 U19.7(VI1/VO1) U22.19(DIR) U24.19(DIR)
MY_STEP: U6.14(PA4) U19.3(VI2/VO2)
MY_STEP_O: J4.2 J5.2 U19.6(VI2/VO2) U22.16(STEP) U24.16(STEP)
MZ_1A: P26.2 U25.24(OUT1A)
MZ_1B: P26.1 U25.21(OUT1B)
MZ_2A: P26.3 U25.26(OUT2A)
MZ_2B: P26.4 U25.1(OUT2B)
MZ_DIR: U6.13(PA3) U20.2(VI1/VO1)
MZ_DIR_O: J1.4 U20.7(VI1/VO1) U25.19(DIR)
MZ_STEP: U6.12(PA2) U20.3(VI2/VO2)
MZ_STEP_O: J1.2 U20.6(VI2/VO2) U25.16(STEP)
NRST: C17.2 R11.2 U6.7(NRST)
PA11: JP1.4 U6.32(PA11)
PA12: JP1.5 U6.33(PA12)
PB7: JP1.6 U6.43(PB7)
PB11: JP1.7 U6.22(PB11)
PC13: JP1.1 U6.2(PC13-TAMPER-RTC)
PC14: JP1.2 U6.3(PC14-OSC32_IN)
PC15: JP1.3 U6.4(PC15-OSC32_OUT)
PROBE: R91.1 U6.41(PB5)
PWM: P19.2 P21.3 P22.3 R34.2
PWMOUT_1: R106.2 SW2.3 U15.2(A)
PWMOUT_2: R107.2 SW2.1 U13.2(A)
RST: C19.2 P16.5 R13.2 R85.1 U6.42(PB6)
RUN: R89.1 U6.40(PB4/JNTRST)
RXD: R14.2 R40.1 U6.31(PA10)
SPINDLE_PWM: SW2.2 U30.7(VI1/VO1)
SPINDLE_PWM_O: R16.2 U6.29(PA8) U30.2(VI1/VO1)
SPN+: C71.1 DZ2.2 P2.1 P18.2 R33.1
SPN_PWM: DZ3.2 Q1.1(G) Q3.2(C) R36.1 R37.1 R38.1 R42.1 R110.1 U31.2
SPN_PWM_OUT: Q2.1(G) R109.1 R110.2 U31.4
SWCLK: P7.3 U6.37(PA14/JTCK/SWCLK)
SWDIO: P7.4 U6.34(PA13/JTMS/SWDIO)
TXD: R15.2 R39.1 U6.30(PA9)
USB-CHK: R4.2 R5.1 U6.19(PB1)
USB_DM: U29.3(I/O2) USB1.2(D-)
USB_DM_1: U8.6 U29.4(I/O2)
USB_DP: U29.1(I/O1) USB1.3(D+)
USB_DP_1: U8.5 U29.6(I/O1)
VCH340: Q4.3(D) U8.16
VUSB: C15.2 D4.1 D5.1 R3.2 R4.1 R101.2 U29.5(VBUS) USB1.1(VBUS)
X_LIMT: R10.1 U6.25(PB12) U7.4
XTAL1: C23.1 R23.1 U6.5(OSC_IN/PD0) Y2.1(OSC1)
XTAL2: C22.1 R23.2 U6.6(OSC_OUT/PD1) Y2.2(OSC2)
Y_LIMT: R20.1 U6.26(PB13) U10.4
Z_LIMT: R28.1 U6.27(PB14) U12.4
ZERO: R95.1 U6.45(PB8)
$1N58: P16.6 R39.2
$1N79: P16.8 R40.2
$1N312: C47.2 U21.5(CP2)
$1N313: C47.1 U21.4(CP1)
$1N314: C52.1 U21.6(VCP)
$1N330: C57.1 U21.8(VREG)
$1N353: R66.2 U21.12(~RESET~) U21.14(~SLEEP~)
$1N397: R60.2(TAP) U21.17(REF)
$1N462: R46.2 U21.23(SENSE1)
$1N491: R45.1 U21.27(SENSE2)
$1N562: C48.2 U22.5(CP2)
$1N563: C48.1 U22.4(CP1)
$1N564: C53.1 U22.6(VCP)
$1N580: C58.1 U22.8(VREG)
$1N603: R67.2 U22.12(~RESET~) U22.14(~SLEEP~)
$1N647: R61.2(TAP) U22.17(REF)
$1N712: R48.2 U22.23(SENSE1)
$1N741: R47.1 U22.27(SENSE2)
$1N812: C50.2 U24.5(CP2)
$1N813: C50.1 U24.4(CP1)
$1N814: C55.1 U24.6(VCP)
$1N830: C60.1 U24.8(VREG)
$1N853: R68.2 U24.12(~RESET~) U24.14(~SLEEP~)
$1N897: R63.2(TAP) U24.17(REF)
$1N962: R52.2 U24.23(SENSE1)
$1N991: R51.1 U24.27(SENSE2)
$1N1062: C51.2 U25.5(CP2)
$1N1063: C51.1 U25.4(CP1)
$1N1064: C56.1 U25.6(VCP)
$1N1080: C61.1 U25.8(VREG)
$1N1103: R69.2 U25.12(~RESET~) U25.14(~SLEEP~)
$1N1147: R64.2(TAP) U25.17(REF)
$1N1212: R54.2 U25.23(SENSE1)
$1N1241: R53.1 U25.27(SENSE2)
$1N2042: D9.2 D10.2 DZ2.1 P18.1 Q2.2(D)
$1N2146: D8.2 DZ1.1 P17.1 Q1.2(D)
$1N2614: P28.2 P28.4 P28.6 R75.2
$1N2698: D6.2 U6.38(PA15/JTDI)
$1N3462: R72.2 U21.13(~ROSC~)
$1N3499: R70.2 U22.13(~ROSC~)
$1N3500: R73.2 U24.13(~ROSC~)
$1N3519: R74.2 U25.13(~ROSC~)
$1N3579: C18.1 U8.4
$1N3617: C19.1 U8.13
$1N3756: R41.1 U15.4(Y)
$1N3757: Q3.1(B) R35.1 R41.2
$1N4012: R55.1 R60.3(B)
$1N4029: R56.1 R61.3(B)
$1N4046: R58.1 R63.3(B)
$1N4065: R59.1 R64.3(B)
$1N4086: D8.1 R30.2
$1N4090: D9.1 R33.2
$1N4091: R34.1 U13.4(Y)
$1N4108: D6.1 R21.1
$1N4117: D5.2 R12.2
$1N4130: D1.1 R1.2
$1N4141: R14.1 U8.2
$1N4142: R15.1 U8.3
$1N11258: C49.2 U23.5(CP2)
$1N11262: C49.1 U23.4(CP1)
$1N11264: C54.1 U23.6(VCP)
$1N11268: C59.1 U23.8(VREG)
$1N11270: R65.2 U23.12(~RESET~) U23.14(~SLEEP~)
$1N11280: R62.2(TAP) U23.17(REF)
$1N11295: R50.2 U23.23(SENSE1)
$1N11308: R49.1 U23.27(SENSE2)
$1N11356: R71.2 U23.13(~ROSC~)
$1N11367: R57.1 R62.3(B)
$1N15432: C20.1 R22.2 U8.7 Y1.2(OSC2)
$1N15439: C21.1 R22.1 U8.8 Y1.1(OSC1)
$1N16577: D3.2 L2.1 L3.1 U2.2(OUTPUT)
$1N17561: D2.2 L1.1 U1.2(OUTPUT)
$1N27338: R9.1 U7.1
$1N27437: R19.1 U10.1
$1N31269: C65.2 P12.2 R87.2 R88.1
$1N31375: C66.2 P9.2 R89.2 R90.1
$1N31481: C67.2 P29.2 R91.2 R92.1
$1N31587: C68.2 P13.2 R93.2 R94.1
$1N31693: C69.2 P20.2 R95.2 R96.1
$1N31978: C64.2 K1.3 K1.4 P5.2 R85.2 R86.1
$1N39709: Q4.1(G) R99.1
$1N39766: Q5.1(B) R100.1 R101.1
$1N39960: Q5.2(C) R99.2 R102.1
$1N40741: P30.1 Q6.3(D)
$1N40811: Q6.1(G) R97.2 R103.1
$1N40965: D13.2 P8.1 P10.1 U10.2
$1N40976: R27.1 U12.1
$1N53890: R108.1 U31.1
$1N54125: D12.2 P4.1 P6.1 U7.2
$1N54135: D14.2 P11.1 P14.1 U12.2

Not connected (* = marked no-connect by the designer): P16 7; U6 1(VBAT); U8 9 10 11 12 14 15; U13 1(NC); U15 1(NC); U21 7(NC) 20(NC) 25(NC); U22 7(NC) 20(NC) 25(NC); U23 7(NC) 20(NC) 25(NC); U24 7(NC) 20(NC) 25(NC); U25 7(NC) 20(NC) 25(NC)

## Notes on the sheet
- updat1: 按键换开关插座（3.96_3PIN)
- updat4: 5V电源做隔离处理
- updat3: 12-24V输入转5.0V输出，再转3.3V给系统供电
- updat3: 12-24V输入转5.0V输出，再转3.3V给系统供电
- updat5: USB换成方形，加TVS管保护，晶振加1M电阻
- updat7: 单片机外围地改为保护地
- updat7: 外部按键用光耦隔离
- updat6: 加开关切换主轴与激光输出
- 输出与输入相同
- updat8: 马达驱动加数字隔离
- 主轴PWMOUT_1
- 激光PWMOUT_2
- 输出与输入反相
- updat9: 增加1路马达输出
- updat8: 马达驱动加数字隔离
